# Altium schematic sheet Sheet1.SchDoc
size A2; SheetNumber: 1; SheetTotal: 1
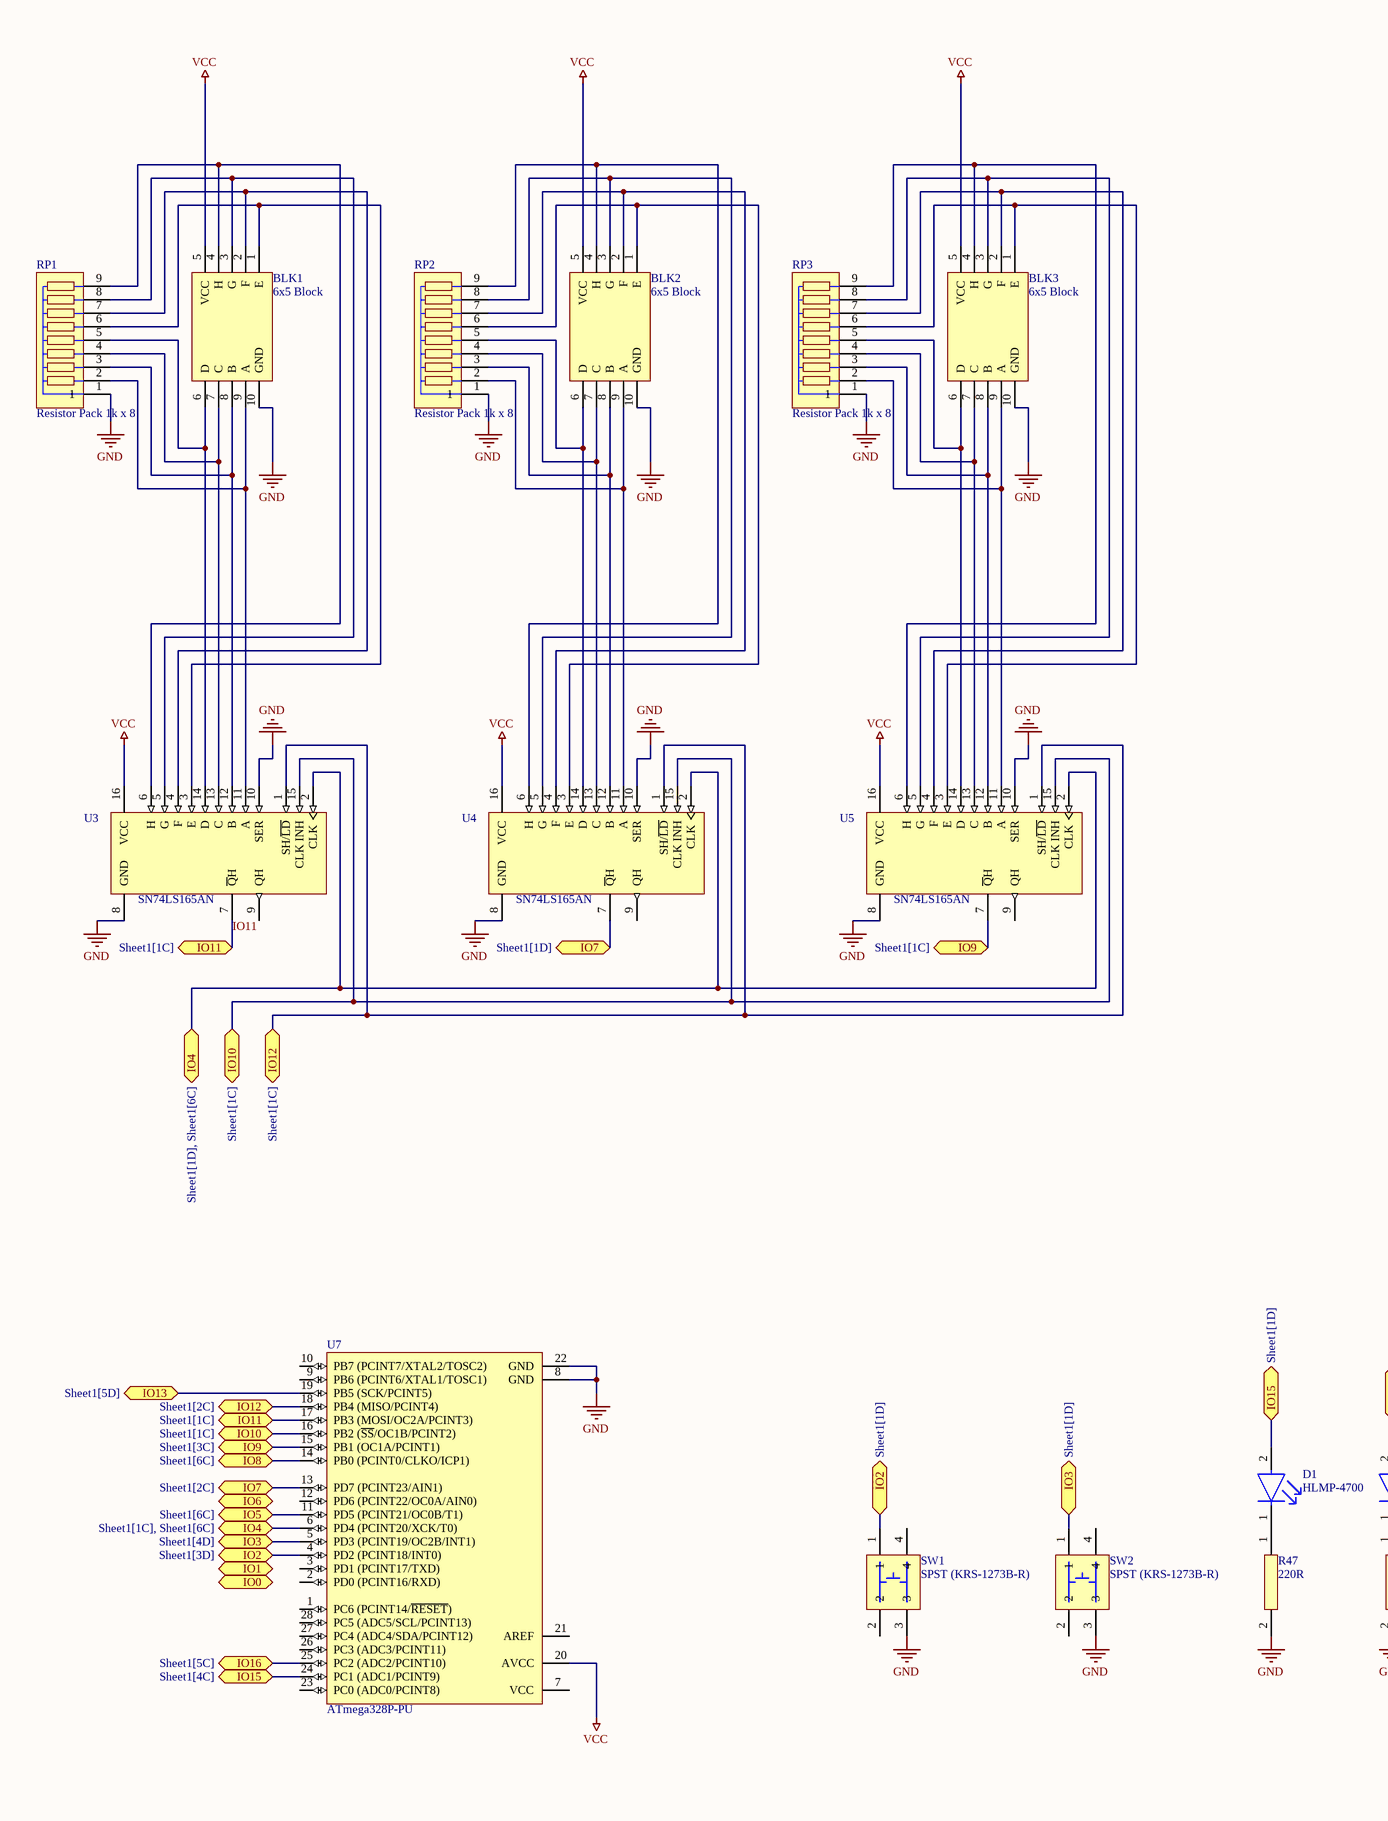
[diagram p0: Sheet1.SchDoc, left]
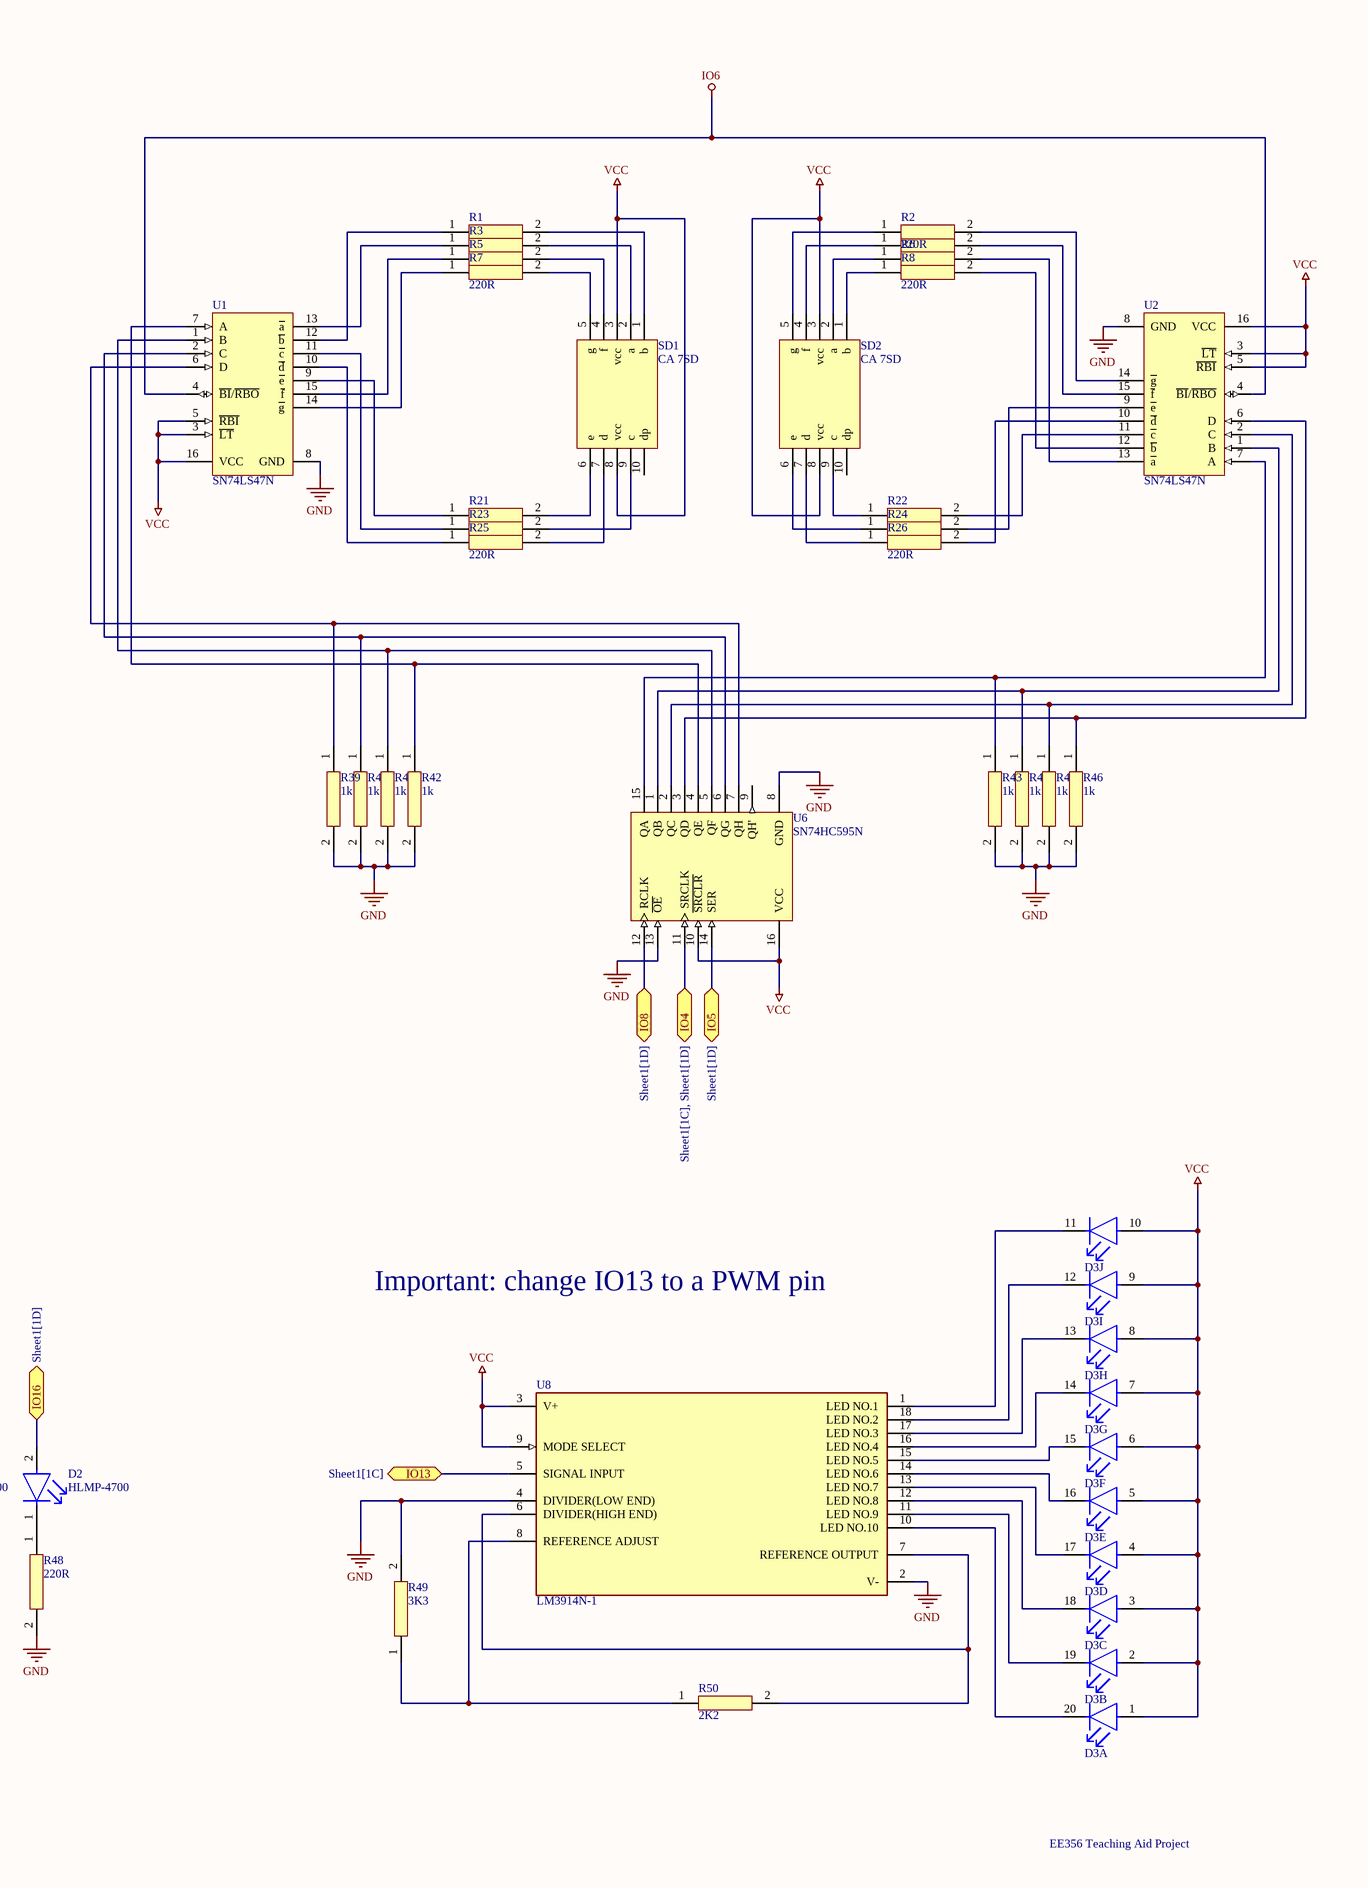
[diagram p1: Sheet1.SchDoc, right]

## Parts
BLK1  6x5 Block  [Block_6x5]
BLK2  6x5 Block  [Block_6x5]
BLK3  6x5 Block  [Block_6x5]
D1  HLMP-4700  [FP-HLMP-4700-MFG]
D2  HLMP-4700  [FP-HLMP-4700-MFG]
D3  SSA-LXB10HW-GF/LP  [FP-SSA-LXB10HW-GF-LP-MFG]  (value not drawn)  (parts A,B,C,D,E,F,G,H,I,J of 10)
R1  220R  [CFR_400mil]
R2  220R  [CFR_400mil]
R3  220R  [CFR_400mil]
R4  220R  [CFR_400mil]
R5  220R  [CFR_400mil]
R6  220R  [CFR_400mil]
R7  220R  [CFR_400mil]
R8  220R  [CFR_400mil]
R21  220R  [CFR_400mil]
R22  220R  [CFR_400mil]
R23  220R  [CFR_400mil]
R24  220R  [CFR_400mil]
R25  220R  [CFR_400mil]
R26  220R  [CFR_400mil]
R39  1k  [CFR_400mil]
R40  1k  [CFR_400mil]
R41  1k  [CFR_400mil]
R42  1k  [CFR_400mil]
R43  1k  [CFR_400mil]
R44  1k  [CFR_400mil]
R45  1k  [CFR_400mil]
R46  1k  [CFR_400mil]
R47  220R  [CFR_400mil]
R48  220R  [CFR_400mil]
R49  3K3  [CFR_400mil]
R50  2K2  [CFR_400mil]
RP1  Resistor Pack 1k x 8  [Resistor Pack 1k x 8]
RP2  Resistor Pack 1k x 8  [Resistor Pack 1k x 8]
RP3  Resistor Pack 1k x 8  [Resistor Pack 1k x 8]
SD1  CA 7SD  [CA 7SD]
SD2  CA 7SD  [CA 7SD]
SW1  SPST (KRS-1273B-R)  [SPST KRS-1273B-R]
SW2  SPST (KRS-1273B-R)  [SPST KRS-1273B-R]
U1  SN74LS47N  [N0016A]
U2  SN74LS47N  [N0016A]
U3  SN74LS165AN  [N0016A]
U4  SN74LS165AN  [N0016A]
U5  SN74LS165AN  [N0016A]
U6  SN74HC595N  [N0016A]
U7  ATmega328P-PU  [28P3]
U8  LM3914N-1  [FP-NFK0018A-MFG]

## Ports
IO0 (bidir), IO1 (bidir), IO2 (bidir, see Sheet1[1D]), IO2 (bidir, see Sheet1[3D]), IO3 (bidir, see Sheet1[1D]), IO3 (bidir, see Sheet1[4D]), IO4 (bidir, see Sheet1[1C], Sheet1[1D]), IO4 (bidir, see Sheet1[1C], Sheet1[6C]), IO4 (bidir, see Sheet1[1D], Sheet1[6C]), IO5 (bidir, see Sheet1[1D]), IO5 (bidir, see Sheet1[6C]), IO6 (bidir), IO7 (bidir, see Sheet1[1D]), IO7 (bidir, see Sheet1[2C]), IO8 (bidir, see Sheet1[1D]), IO8 (bidir, see Sheet1[6C]), IO9 (bidir, see Sheet1[1C]), IO9 (bidir, see Sheet1[3C]), IO10 (bidir, see Sheet1[1C]), IO11 (bidir, see Sheet1[1C]), IO12 (bidir, see Sheet1[1C]), IO12 (bidir, see Sheet1[2C]), IO13 (bidir, see Sheet1[1C]), IO13 (bidir, see Sheet1[5D]), IO15 (bidir, see Sheet1[1D]), IO15 (bidir, see Sheet1[4C]), IO16 (bidir, see Sheet1[1D]), IO16 (bidir, see Sheet1[5C])

## Nets
GND: BLK1.10(GND) BLK2.10(GND) BLK3.10(GND) R39.2 R40.2 R41.2 R42.2 R43.2 R44.2 R45.2 R46.2 R47.2 R48.2 R49.2 RP1.1 RP2.1 RP3.1 SW1.3 SW2.3 U1.8(GND) U2.8(GND) U3.8(GND) U3.10(SER) U4.8(GND) U4.10(SER) U5.8(GND) U5.10(SER) U6.8(GND) U6.13(~{OE}) U7.8(GND) U7.22(GND) U8.2(V-) U8.4(DIVIDER(LOW_END))
IO6: U1.4(~{BI}/~{RBO}) U2.4(~{BI}/~{RBO})
VCC: BLK1.5(VCC) BLK2.5(VCC) BLK3.5(VCC) D3.1(1_ANODE) D3.2(2_ANODE) D3.3(3_ANODE) D3.4(4_ANODE) D3.5(5_ANODE) D3.6(6_ANODE) D3.7(7_ANODE) D3.8(8_ANODE) D3.9(9_ANODE) D3.10(10_ANODE) SD1.3(vcc) SD1.8(vcc) SD2.3(vcc) SD2.8(vcc) U1.3(~{LT}) U1.5(~{RBI}) U1.16(VCC) U2.3(~{LT}) U2.5(~{RBI}) U2.16(VCC) U3.16(VCC) U4.16(VCC) U5.16(VCC) U6.10(~{SRCLR}) U6.16(VCC) U7.20(AVCC) U8.3(V+) U8.9(MODE_SELECT)
IO2: SW1.1 U7.4(PD2_(PCINT18/INT0)) ; port IO2
IO3: SW2.1 U7.5(PD3_(PCINT19/OC2B/INT1)) ; port IO3
IO4: U3.2(CLK) U4.2(CLK) U5.2(CLK) U6.11(SRCLK) U7.6(PD4_(PCINT20/XCK/T0)) ; port IO4
IO5: U6.14(SER) U7.11(PD5_(PCINT21/OC0B/T1)) ; port IO5
IO7: U4.7(~{Q}H) U7.13(PD7_(PCINT23/AIN1)) ; port IO7
IO8: U6.12(RCLK) U7.14(PB0_(PCINT0/CLKO/ICP1)) ; port IO8
IO9: U5.7(~{Q}H) U7.15(PB1_(OC1A/PCINT1)) ; port IO9
IO10: U3.15(CLK_INH) U4.15(CLK_INH) U5.15(CLK_INH) U7.16(PB2_(~{SS}/OC1B/PCINT2)) ; port IO10
IO11: U3.7(~{Q}H) U7.17(PB3_(MOSI/OC2A/PCINT3)) ; port IO11
IO12: U3.1(SH/~{LD}) U4.1(SH/~{LD}) U5.1(SH/~{LD}) U7.18(PB4_(MISO/PCINT4)) ; port IO12
IO13: U7.19(PB5_(SCK/PCINT5)) U8.5(SIGNAL_INPUT) ; port IO13
IO15: D1.2(A) U7.24(PC1_(ADC1/PCINT9)) ; port IO15
IO16: D2.2(A) U7.25(PC2_(ADC2/PCINT10)) ; port IO16
NetBLK1_1: BLK1.1(E) RP1.6 U3.3(E)
NetBLK1_2: BLK1.2(F) RP1.7 U3.4(F)
NetBLK1_3: BLK1.3(G) RP1.8 U3.5(G)
NetBLK1_4: BLK1.4(H) RP1.9 U3.6(H)
NetBLK1_6: BLK1.6(D) RP1.5 U3.14(D)
NetBLK1_7: BLK1.7(C) RP1.4 U3.13(C)
NetBLK1_8: BLK1.8(B) RP1.3 U3.12(B)
NetBLK1_9: BLK1.9(A) RP1.2 U3.11(A)
NetBLK2_1: BLK2.1(E) RP2.6 U4.3(E)
NetBLK2_2: BLK2.2(F) RP2.7 U4.4(F)
NetBLK2_3: BLK2.3(G) RP2.8 U4.5(G)
NetBLK2_4: BLK2.4(H) RP2.9 U4.6(H)
NetBLK2_6: BLK2.6(D) RP2.5 U4.14(D)
NetBLK2_7: BLK2.7(C) RP2.4 U4.13(C)
NetBLK2_8: BLK2.8(B) RP2.3 U4.12(B)
NetBLK2_9: BLK2.9(A) RP2.2 U4.11(A)
NetBLK3_1: BLK3.1(E) RP3.6 U5.3(E)
NetBLK3_2: BLK3.2(F) RP3.7 U5.4(F)
NetBLK3_3: BLK3.3(G) RP3.8 U5.5(G)
NetBLK3_4: BLK3.4(H) RP3.9 U5.6(H)
NetBLK3_6: BLK3.6(D) RP3.5 U5.14(D)
NetBLK3_7: BLK3.7(C) RP3.4 U5.13(C)
NetBLK3_8: BLK3.8(B) RP3.3 U5.12(B)
NetBLK3_9: BLK3.9(A) RP3.2 U5.11(A)
NetD1_1: D1.1(C) R47.1
NetD2_1: D2.1(C) R48.1
NetD3_11: D3.11(10_CATHODE) U8.1(LED_NO.1)
NetD3_12: D3.12(9_CATHODE) U8.18(LED_NO.2)
NetD3_13: D3.13(8_CATHODE) U8.17(LED_NO.3)
NetD3_14: D3.14(7_CATHODE) U8.16(LED_NO.4)
NetD3_15: D3.15(6_CATHODE) U8.15(LED_NO.5)
NetD3_16: D3.16(5_CATHODE) U8.14(LED_NO.6)
NetD3_17: D3.17(4_CATHODE) U8.13(LED_NO.7)
NetD3_18: D3.18(3_CATHODE) U8.12(LED_NO.8)
NetD3_19: D3.19(2_CATHODE) U8.11(LED_NO.9)
NetD3_20: D3.20(1_CATHODE) U8.10(LED_NO.10)
NetR1_1: R1.1 U1.12(~{b})
NetR1_2: R1.2 SD1.1(b)
NetR2_1: R2.1 SD2.5(g)
NetR2_2: R2.2 U2.14(~{g})
NetR3_1: R3.1 U1.13(~{a})
NetR3_2: R3.2 SD1.2(a)
NetR4_1: R4.1 SD2.4(f)
NetR4_2: R4.2 U2.15(~{f})
NetR5_1: R5.1 U1.15(~{f})
NetR5_2: R5.2 SD1.4(f)
NetR6_1: R6.1 SD2.2(a)
NetR6_2: R6.2 U2.13(~{a})
NetR7_1: R7.1 U1.14(~{g})
NetR7_2: R7.2 SD1.5(g)
NetR8_1: R8.1 SD2.1(b)
NetR8_2: R8.2 U2.12(~{b})
NetR21_1: R21.1 U1.9(~{e})
NetR21_2: R21.2 SD1.6(e)
NetR22_1: R22.1 SD2.9(c)
NetR22_2: R22.2 U2.11(~{c})
NetR23_1: R23.1 U1.11(~{c})
NetR23_2: R23.2 SD1.9(c)
NetR24_1: R24.1 SD2.6(e)
NetR24_2: R24.2 U2.9(~{e})
NetR25_1: R25.1 U1.10(~{d})
NetR25_2: R25.2 SD1.7(d)
NetR26_1: R26.1 SD2.7(d)
NetR26_2: R26.2 U2.10(~{d})
NetR39_1: R39.1 U1.6(D) U6.7(QH)
NetR40_1: R40.1 U1.2(C) U6.6(QG)
NetR41_1: R41.1 U1.1(B) U6.5(QF)
NetR42_1: R42.1 U1.7(A) U6.4(QE)
NetR43_1: R43.1 U2.7(A) U6.15(QA)
NetR44_1: R44.1 U2.1(B) U6.1(QB)
NetR45_1: R45.1 U2.2(C) U6.2(QC)
NetR46_1: R46.1 U2.6(D) U6.3(QD)
NetR49_1: R49.1 R50.1 U8.8(REFERENCE_ADJUST)
NetR50_2: R50.2 U8.6(DIVIDER(HIGH_END)) U8.7(REFERENCE_OUTPUT)

Not connected (* = marked no-connect by the designer): SD1 10(dp); SD2 10(dp); SW1 2 4; SW2 2 4; U3 9(QH); U4 9(QH); U5 9(QH); U6 9(QH'); U7 1(PC6_(PCINT14/~{RESET})) 2(PD0_(PCINT16/RXD)) 3(PD1_(PCINT17/TXD)) 7(VCC) 9(PB6_(PCINT6/XTAL1/TOSC1)) 10(PB7_(PCINT7/XTAL2/TOSC2)) 12(PD6_(PCINT22/OC0A/AIN0)) 21(AREF) 23(PC0_(ADC0/PCINT8)) 26(PC3_(ADC3/PCINT11)) 27(PC4_(ADC4/SDA/PCINT12)) 28(PC5_(ADC5/SCL/PCINT13))

## Notes on the sheet
- Important: change IO13 to a PWM pin
- EE356 Teaching Aid Project

## Library data of the parts
BLK1-BLK3 = Block_6x5
D1 D2 = CMP-18399-000008-1: LED RED DIFFUSED T-1 3/4 T/H; Manufacturer: Broadcom; Luminous Intensity: 2.3mcd; Peak Emmision Wavelength: 635nm; Forward Voltage: 1.7V; Viewing Angle: 50°; Led Orientation: Straight; Reverse Voltage: 5V; Forward Current: 2mA; Power Dissipation: 14mW; Wavelength: 626nm; Digikey Description: LED RED DIFFUSED T-1 3/4 T/H; Device Class L3: unset; Temperature Range Low: -40°C; Temperature Range High: +100°C; RoHS: TRUE; Package: HLMP-4700; Octopart: https://octopart.com/hlmp-4700-broadcom-71130526; Automotive: No; ComponentLink2URL: https://docs.broadcom.com/docs/AV02-1557EN; Colour: Red; Temperature: -40°C to +100°C; Lead Free: Yes; Category: Diode; ComponentLink2Description: Datasheet; Manufacturer Part Number: HLMP-4700; Device Class L1: Optoelectronics; Device Class L2: LEDs; Mouser Description: LED; Red; 2.3mcd; 0.24In.Dia.; T-1-3/4; 500mA; 1.7V; 635nm; 50deg; 5V; 24mW; -55degC;
D3 = CMP-57188-000001-1: LED ARRAY 10X25MM 10SEG RED DIFF; Manufacturer: lumex; Luminous Intensity: 500mcd; Power Dissipation: 105mW; Forward Current: 20mA; Display Type: Bar Graph; Reverse Voltage: 5V; Forward Voltage: 2V; Viewing Angle: 160°; RoHS: TRUE; Device Class L2: Displays; Octopart: https://octopart.com/ssa-lxb10hw-gf%2Flp-lumex-548235; Digikey Description: LED ARRAY 10X25MM 10SEG RED DIFF; Test Current: 20mA; Manufacturer Part Number: SSA-LXB10HW-GF/LP; Device Class L1: Optoelectronics; Mouser Description: LED Bars and Arrays 10 Segment Red; Temperature Range Low: -40°C; ComponentLink2URL: https://www.lumex.com/spec/SSA-LXB10HW-GF-LP.pdf; Automotive: No; Height: 7.05mm; Device Class L3: LED Displays; Category: Diode; Package: SSA-LXB10HW-GF/LP; Temperature: -40°C to +85°C; ComponentLink2Description: Datasheet; Temperature Range High: +85°C; Lead Free: Yes
R1-R8 R21-R26 R47 R48 = CFR-25JB-52-220R: General Type Carbon Film Resistor 220Ohm 1/4W 5% Axial Bulk; Manufacturer: Yageo; Temperature Coefficient: 500ppm/°C; Max Power Dissipation: 250mW; Supplier 1: Digi-Key; Manufacturer Part Number: CFR-25JB-52-220R; RoHS: Yes; Category: Through-Hole Resistors; Stock 1: 1583; Pricing 1: 1=0.10000, 10=0.06800, 25=0.04680, 50=0.03640, 100=0.02600, 250=0.02028, 500=0.01612, 1000=0.01144, 5000=0.00884 (USD); Case/Package: Axial; Min Operating Temperature: -55°C; Max Operating Temperature: 155°C; Package Quantity: 200; Packaging: Bulk; Resistance: 220R; Tolerance: 5%; Resistor Type: Carbon Film; Number of Terminations: 2; Series: Carbon Film; Length: 0.248inch; RoHS Compliant: Yes; ComponentLink1URL: http://www.mouser.com/ds/2/447/Yageo%20LR_CFR_2013-540723.pdf?src-supplier=Mouser; ComponentLink1Description: http://www.mouser.com/ds/2/447/Yageo%20LR_CFR_2013-540723.pdf?src-supplier=Mouser; ComponentLink2URL: http://www.yageo.com/NewPortal/yageodocoutput?fileName=/pdf/throughhole/Yageo_LR_CFR_2013.pdf&src-supplier=Digi-Key; ComponentLink2Description: http://www.yageo.com/NewPortal/yageodocoutput?fileName=/pdf/throughhole/Yageo_LR_CFR_2013.pdf&src-supplier=Digi-Key; Supplier Part Number 1: 220QBK-ND
R39-R46 = CFR-25JB-52-1K: Res Carbon Film 1K Ohm 5% 1/4W -350ppm/°C to 350ppm/°C Conformal AXL Thru-Hole Bulk; Manufacturer: Yageo; Resistance: 1kR; Temperature Coefficient: 500ppm/°C; Max Power Dissipation: 250mW; Supplier 1: Arrow Electronics; Manufacturer Part Number: CFR-25JB-52-1K; RoHS: Yes; Category: Through-Hole Resistors; Stock 1: 79490; Pricing 1: 1=0.05400, 10=0.03800, 25=0.02750, 50=0.02230, 100=0.01120, 250=0.01090, 500=0.01080, 1000=0.01030, 5000=0.00780 (USD); Case/Package: Axial; Min Operating Temperature: -55°C; Max Operating Temperature: 155°C; Tolerance: 5%; Package Quantity: 200; Packaging: Bulk; Resistor Type: Carbon Film; Number of Terminations: 2; Series: Carbon Film; Power Rating: 250mW; Length: 0.248inch; RoHS Compliant: Yes; Lead Free: Lead Free; ComponentLink1URL: http://www.yageo.com/NewPortal/yageodocoutput?fileName=/pdf/throughhole/Yageo_LR_CFR_2013.pdf&src-supplier=Digi-Key; ComponentLink1Description: http://www.yageo.com/NewPortal/yageodocoutput?fileName=/pdf/throughhole/Yageo_LR_CFR_2013.pdf&src-supplier=Digi-Key; ComponentLink2URL: http://www.yageo.com/documents/recent/General%20Type_CFR.pdf?src-supplier=Future+Electronics; ComponentLink2Description: http://www.yageo.com/documents/recent/General%20Type_CFR.pdf?src-supplier=Future+Electronics; Supplier Part Number 1: CFR-25JB-52-1K
R49 = CFR-25JB-52-3K3: General Type Carbon Film Resistor 3.3kOhm 1/4W 5% Axial Bulk; Manufacturer: Yageo; Manufacturer Part Number: CFR-25JB-52-220R; Resistance: 220R; Temperature Coefficient: 500ppm/°C; Max Power Dissipation: 250mW; Supplier 1: Digi-Key; RoHS: Yes; Category: Through-Hole Resistors; Stock 1: 1583; Pricing 1: 1=0.10000, 10=0.06800, 25=0.04680, 50=0.03640, 100=0.02600, 250=0.02028, 500=0.01612, 1000=0.01144, 5000=0.00884 (USD); Case/Package: Axial; Min Operating Temperature: -55°C; Max Operating Temperature: 155°C; Package Quantity: 200; Packaging: Bulk; Tolerance: 5%; Resistor Type: Carbon Film; Number of Terminations: 2; Series: Carbon Film; Length: 0.248inch; RoHS Compliant: Yes; ComponentLink1URL: http://www.mouser.com/ds/2/447/Yageo%20LR_CFR_2013-540723.pdf?src-supplier=Mouser; ComponentLink1Description: http://www.mouser.com/ds/2/447/Yageo%20LR_CFR_2013-540723.pdf?src-supplier=Mouser; ComponentLink2URL: http://www.yageo.com/NewPortal/yageodocoutput?fileName=/pdf/throughhole/Yageo_LR_CFR_2013.pdf&src-supplier=Digi-Key; ComponentLink2Description: http://www.yageo.com/NewPortal/yageodocoutput?fileName=/pdf/throughhole/Yageo_LR_CFR_2013.pdf&src-supplier=Digi-Key; Supplier Part Number 1: 220QBK-ND
R50 = CFR-25JB-52-2K2: General Type Carbon Film Resistor 2.2kOhm 1/4W 5% Axial Bulk; Manufacturer: Yageo; Manufacturer Part Number: CFR-25JB-52-220R; Resistance: 220R; Temperature Coefficient: 500ppm/°C; Max Power Dissipation: 250mW; Supplier 1: Digi-Key; RoHS: Yes; Category: Through-Hole Resistors; Stock 1: 1583; Pricing 1: 1=0.10000, 10=0.06800, 25=0.04680, 50=0.03640, 100=0.02600, 250=0.02028, 500=0.01612, 1000=0.01144, 5000=0.00884 (USD); Case/Package: Axial; Min Operating Temperature: -55°C; Max Operating Temperature: 155°C; Package Quantity: 200; Packaging: Bulk; Tolerance: 5%; Resistor Type: Carbon Film; Number of Terminations: 2; Series: Carbon Film; Length: 0.248inch; RoHS Compliant: Yes; ComponentLink1URL: http://www.mouser.com/ds/2/447/Yageo%20LR_CFR_2013-540723.pdf?src-supplier=Mouser; ComponentLink1Description: http://www.mouser.com/ds/2/447/Yageo%20LR_CFR_2013-540723.pdf?src-supplier=Mouser; ComponentLink2URL: http://www.yageo.com/NewPortal/yageodocoutput?fileName=/pdf/throughhole/Yageo_LR_CFR_2013.pdf&src-supplier=Digi-Key; ComponentLink2Description: http://www.yageo.com/NewPortal/yageodocoutput?fileName=/pdf/throughhole/Yageo_LR_CFR_2013.pdf&src-supplier=Digi-Key; Supplier Part Number 1: 220QBK-ND
RP1-RP3 = 4309R-101-102LF: Res Thick Film NET 1K Ohm 2% 1.13W ±100ppm/°C BUS Molded 9-Pin SIP Pin Thru-Hole; Manufacturer: Bourns; Number of Terminals/Pins: 9; Resistance: 1kR; Voltage Rating: 100V; Number of Elements: 8; Circuit Type: Bussed; Power Per Element: 200mW; Supplier 1: Avnet; Manufacturer Part Number: 4309R-101-102LF; RoHS: Yes; Category: Resistor Arrays; Stock 1: 21; Pricing 1: 1=1.42000 (USD); Mount: Through Hole; Case/Package: SIP; Number of Pins: 9; Min Operating Temperature: -55°C; Max Operating Temperature: 125°C; Tolerance: 2%; Power Rating: 1.13W; Packaging: Rail/Tube; Package Quantity: 22; Number of Resistors: 8; Termination: SIP; Temperature Coefficient: 100ppm/°C; Voltage Rating (DC): 100V; Series: 4300R; Resistance Tolerance: 2%; Technology: THICK FILM; Length: 0.884inch; Width: 0.085inch; Height: 0.195inch; Lead Pitch: 2.54mm; Terminal Pitch: 2.54mm; Depth: 2.16mm; Radiation Hardening: No; Reach SVHC Compliant: Yes; Military Standard: Not; RoHS Compliant: Yes; ComponentLink1URL: https://datasheet.ciiva.com/1132/1639105-1132861.pdf?src-supplier=Element14; ComponentLink1Description: https://datasheet.ciiva.com/1132/1639105-1132861.pdf?src-supplier=Element14; ComponentLink2URL: https://datasheet.ciiva.com/3264/4300r-3264093.pdf?src-supplier=Avnet; ComponentLink2Description: https://datasheet.ciiva.com/3264/4300r-3264093.pdf?src-supplier=Avnet; ComponentLink3URL: https://datasheet.ciiva.com/6494/4300r-6494366.pdf?src-supplier=Digi-Key; ComponentLink3Description: https://datasheet.ciiva.com/6494/4300r-6494366.pdf?src-supplier=Digi-Key; ComponentLink4URL: https://datasheet.ciiva.com/14583/70154247-14583487.pdf?src-supplier=Allied+Electronics; ComponentLink4Description: https://datasheet.ciiva.com/14583/70154247-14583487.pdf?src-supplier=Allied+Electronics; Supplier Part Number 1: 32K9075
SD1 SD2 = LDS-A5642RI: Single Digit Seven Segment Green 0.56" Common Anode Through Hole LED Display; Manufacturer: Lumex; Forward Current: 10mA; Forward Voltage: 2.2V; Number of LEDs: 8; Wavelength: 565nm; Max Power Dissipation: 105mW; Luminous Intensity: 3.9mcd; Number of Contacts: 10; Viewing Area (height): 14.2mm; Supplier 1: Future Electronics; Manufacturer Part Number: LDS-A5642RI; RoHS: Yes; Category: LED Displays; Pricing 1: 1=0.91500, 50=0.88000, 200=0.84000, 750=0.80500, 2500=0.74000 (USD); Mount: Through Hole; Case/Package: DIP; Number of Pins: 10; Color: Green; Min Operating Temperature: -40°C; Max Operating Temperature: 85°C; Element Configuration: Common Anode; Test Current: 10mA; Display Type: Segment; Package Quantity: 40; Illumination Color: Green; Packaging: Bulk; Operating Supply Voltage: 2.2V; Power Consumption: 105mW; Length: 0.67inch; Width: 0.5inch; Height: 0.32inch; RoHS Compliant: Yes; Lead Free: Lead Free; ComponentLink1URL: https://datasheet.ciiva.com/16294/lds-a5642ri-16294404.pdf?src-supplier=Future+Electronics; ComponentLink1Description: https://datasheet.ciiva.com/16294/lds-a5642ri-16294404.pdf?src-supplier=Future+Electronics; ComponentLink2URL: https://datasheet.ciiva.com/4421/lds-a5642ri-33718-4421941.pdf?src-supplier=Mouser; ComponentLink2Description: https://datasheet.ciiva.com/4421/lds-a5642ri-33718-4421941.pdf?src-supplier=Mouser; ComponentLink3URL: https://datasheet.ciiva.com/30079/lds-a5642ri-30079851.pdf?src-supplier=Onlinecomponents.com; ComponentLink3Description: https://datasheet.ciiva.com/30079/lds-a5642ri-30079851.pdf?src-supplier=Onlinecomponents.com; Supplier Part Number 1: 8628562
SW1 SW2 = KRS-1273B-R: Switch Push Button Tactile Off Momentary (On) Single Pole Single Throw Cap: 155389 155409; Manufacturer: Jameco Valuepro; Supplier 1: Jameco; Manufacturer Part Number: KRS-1273B-R; RoHS: No; Category: Uncategorized; Stock 1: 2143; Pricing 1: 1=0.45000, 10=0.39000, 100=0.35000, 250=0.29000 (USD); Number of Pins: 4; Termination: PC Pins; Orientation: Straight; Throw Configuration: SPST; ComponentLink1URL: https://datasheet.ciiva.com/19453/155380-19453382.pdf?src-supplier=Jameco; ComponentLink1Description: https://datasheet.ciiva.com/19453/155380-19453382.pdf?src-supplier=Jameco; Supplier Part Number 1: 155380
U1 U2 = CMP-0388-00303-2: BCD-to-7-Segment Decoder / Driver, 4.75 to 5.25 V, 0 to 70 degC, 16-pin DIP (N16), Pb-Free (RoHS); Manufacturer: Texas Instruments; Rating: Catalog; SubFamily: Discrete Segment LED Driver; Vin(Max)(V): 5.25; Vin(Min)(V): 4.75; Eco-Plan: Pb-Free (RoHS); ComponentLink1URL: http://www.ti.com/; PackageReference: N0016A; PackageDescription: 16-Pin Plastic In-Line, Body 19.305 x 6.35 mm, Pitch 2.54 mm; ComponentLink1Description: Manufacturer URL; ComponentLink2URL: http://www.ti.com/general/docs/lit/getliterature.tsp?genericPartNumber=SN74LS47&fileType=pdf; Mounting Technology: Through Hole; ComponentLink3URL: http://www.ti.com/litv/pdf/mpdi002c; Code_JEDEC: MS-001; DatasheetVersion: SDLS111; PartNumber: SN74LS47N; ComponentLink2Description: Datasheet; ComponentLink3Description: Package Specification; PackageVersion: 4040049/E
U3-U5 = CMP-0780-00134-3: Serial-out shift registers, N0016A, TUBE; Manufacturer: Texas Instruments; Input Type: TTL; ICC @ Nom Voltage(Max)(mA): 30; Voltage(Nom)(V): 5; Bits: 8; 3-State Output: No; tpd @ Nom Voltage(Max)(ns): 25; Rating: Catalog; F @ Nom Voltage(Max)(Mhz): 35; Output Drive (IOL/IOH)(Max)(mA): 8/-0.4; VCC(Min)(V): 4.75; Technology Family: LS; VCC(Max)(V): 5.25; Code_JEDEC: MS-001; PackageReference: N0016A; PackageVersion: http://www.ti.com/lit/ml/mpdi002c/mpdi002c.pdf; Generic Part Number: SN74LS165A; Operating Temperature Range(C): 0 to 70; Output Type: TTL; DatasheetVersion: SDLS062D
U6 = CMP-0780-00137-3: 8-Bit Shift Registers With 3-State Output Registers, N0016A, TUBE; Manufacturer: Texas Instruments; F @ Nom Voltage(Max)(Mhz): 28; Input Type: CMOS; Bits: 8; VCC(Min)(V): 2; 3-State Output: Yes; ICC @ Nom Voltage(Max)(mA): 0.08; VCC(Max)(V): 6; tpd @ Nom Voltage(Max)(ns): 34; Rating: Military; Technology Family: HC; Output Drive (IOL/IOH)(Max)(mA): 7.8/-7.8; Code_JEDEC: MS-001; Output Type: CMOS; Operating Temperature Range(C): -40 to 85; Voltage(Nom)(V): 6; Generic Part Number: SN74HC595; DatasheetVersion: SCLS041H; PackageReference: N0016A; PackageVersion: http://www.ti.com/lit/ml/mpdi002c/mpdi002c.pdf
U7 = CMP-0095-00013-2: 8-bit AVR Microcontroller, 32KB Flash, 1KB EEPROM, 2KB SRAM, 28-pin PDIP, Industrial Grade (-40°C to 85°C); RevisionNote: DatasheetVersion updated. URLs added.; PackageVersion: revB, Sep-2001; PackageDescription: 28-lead (0.300"/7.62mm Wide) Plastic Dual Inline Package (PDIP); DatasheetVersion: revD, May-2011; ComponentLink1Description: Manufacturer URL; ComponentLink1URL: http://www.atmel.com/; PackageReference: 28P3; ComponentLink2Description: ATmega48A/48PA/88A/88PA/168A/168PA/328/328P Datasheet; ComponentLink3URL: http://www.atmel.com/dyn/resources/prod_documents/8271S.pdf; ComponentLink2URL: http://www.atmel.com/dyn/resources/prod_documents/8271.pdf; ComponentLink3Description: ATmega48A/48PA/88A/88PA/168A/168PA/328/328P Summary
U8 = CMP-0058-00006-4: IC DRVR DOT/BAR DISPLAY 18DIP; Output Current: 30mA; Supply Current: 9.2mA; Output Voltage: 1.28V; Number of Outputs: 10; Max Output Voltage: 1.34V; Power Dissipation: 1.365W; Operating Supply Current: 6.1mA; Max Input Voltage: 12V; Max Supply Current: 9.2kA; Min Input Voltage: 1.2V; Max Supply Voltage: 25V; Length: 22.86mm; Max Operating Temperature: 70°C; Number of Pins: 18; Radiation Hardening: No; Min Operating Temperature: 0°C; Width: 6.35mm; Nominal Supply Current: 9.2mA; Number of Channels: 10; Packaging: Rail/Tube; Max Power Dissipation: 1.365W; Height: 3.3mm; Package Quantity: 20; REACH SVHC: No SVHC; Mount: Through Hole; Lead Free: Contains Lead; Series: -; Termination: Through Hole; Number of Segments: 10; Case/Package: DIP; RoHS Compliant: No